# Altium schematic sheet Input_scheme.SchDoc
size A4
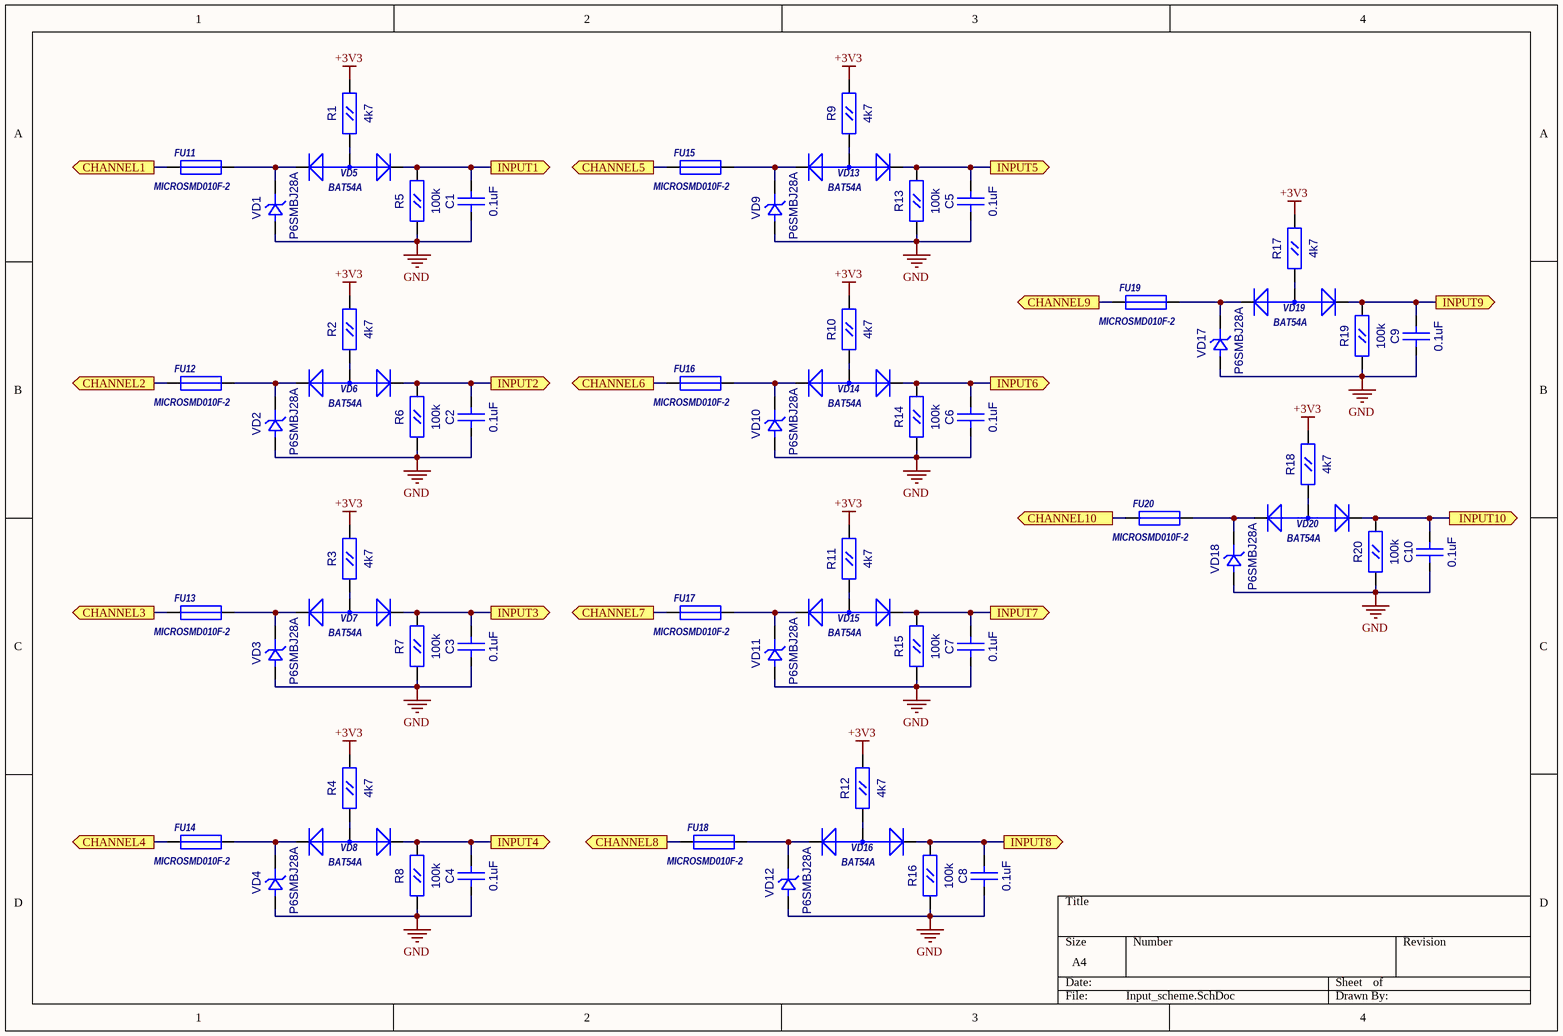
[diagram p0: Input_scheme.SchDoc]

## Parts
C1  0.1uF  [CC0603]
C2  0.1uF  [CC0603]
C3  0.1uF  [CC0603]
C4  0.1uF  [CC0603]
C5  0.1uF  [CC0603]
C6  0.1uF  [CC0603]
C7  0.1uF  [CC0603]
C8  0.1uF  [CC0603]
C9  0.1uF  [CC0603]
C10  0.1uF  [CC0603]
FU11  MICROSMD010F-2  [RC1210]
FU12  MICROSMD010F-2  [RC1210]
FU13  MICROSMD010F-2  [RC1210]
FU14  MICROSMD010F-2  [RC1210]
FU15  MICROSMD010F-2  [RC1210]
FU16  MICROSMD010F-2  [RC1210]
FU17  MICROSMD010F-2  [RC1210]
FU18  MICROSMD010F-2  [RC1210]
FU19  MICROSMD010F-2  [RC1210]
FU20  MICROSMD010F-2  [RC1210]
R1  4k7  [RC0603]
R2  4k7  [RC0603]
R3  4k7  [RC0603]
R4  4k7  [RC0603]
R5  100k  [RC0603]
R6  100k  [RC0603]
R7  100k  [RC0603]
R8  100k  [RC0603]
R9  4k7  [RC0603]
R10  4k7  [RC0603]
R11  4k7  [RC0603]
R12  4k7  [RC0603]
R13  100k  [RC0603]
R14  100k  [RC0603]
R15  100k  [RC0603]
R16  100k  [RC0603]
R17  4k7  [RC0603]
R18  4k7  [RC0603]
R19  100k  [RC0603]
R20  100k  [RC0603]
VD1  P6SMBJ28A  [SMB]
VD2  P6SMBJ28A  [SMB]
VD3  P6SMBJ28A  [SMB]
VD4  P6SMBJ28A  [SMB]
VD5  BAT54A  [SOT-23(123)]
VD6  BAT54A  [SOT-23(123)]
VD7  BAT54A  [SOT-23(123)]
VD8  BAT54A  [SOT-23(123)]
VD9  P6SMBJ28A  [SMB]
VD10  P6SMBJ28A  [SMB]
VD11  P6SMBJ28A  [SMB]
VD12  P6SMBJ28A  [SMB]
VD13  BAT54A  [SOT-23(123)]
VD14  BAT54A  [SOT-23(123)]
VD15  BAT54A  [SOT-23(123)]
VD16  BAT54A  [SOT-23(123)]
VD17  P6SMBJ28A  [SMB]
VD18  P6SMBJ28A  [SMB]
VD19  BAT54A  [SOT-23(123)]
VD20  BAT54A  [SOT-23(123)]

## Ports
CHANNEL1 (out), CHANNEL2 (out), CHANNEL3 (out), CHANNEL4 (out), CHANNEL5 (out), CHANNEL6 (out), CHANNEL7 (out), CHANNEL8 (out), CHANNEL9 (out), CHANNEL10 (out), INPUT1 (out), INPUT2 (out), INPUT3 (out), INPUT4 (out), INPUT5 (out), INPUT6 (out), INPUT7 (out), INPUT8 (out), INPUT9 (out), INPUT10 (out)

## Nets
+3V3: R1.2(B) R2.2(B) R3.2(B) R4.2(B) R9.2(B) R10.2(B) R11.2(B) R12.2(B) R17.2(B) R18.2(B)
GND: C1.1(A) C2.1(A) C3.1(A) C4.1(A) C5.1(A) C6.1(A) C7.1(A) C8.1(A) C9.1(A) C10.1(A) R5.1(A) R6.1(A) R7.1(A) R8.1(A) R13.1(A) R14.1(A) R15.1(A) R16.1(A) R19.1(A) R20.1(A) VD1.1(A) VD2.1(A) VD3.1(A) VD4.1(A) VD9.1(A) VD10.1(A) VD11.1(A) VD12.1(A) VD17.1(A) VD18.1(A)
CHANNEL1: FU11.1 ; port CHANNEL1
CHANNEL2: FU12.1 ; port CHANNEL2
CHANNEL3: FU13.1 ; port CHANNEL3
CHANNEL4: FU14.1 ; port CHANNEL4
CHANNEL5: FU15.1 ; port CHANNEL5
CHANNEL6: FU16.1 ; port CHANNEL6
CHANNEL7: FU17.1 ; port CHANNEL7
CHANNEL8: FU18.1 ; port CHANNEL8
CHANNEL9: FU19.1 ; port CHANNEL9
CHANNEL10: FU20.1 ; port CHANNEL10
INPUT1: C1.2(B) R5.2(B) VD5.2(K) ; port INPUT1
INPUT2: C2.2(B) R6.2(B) VD6.2(K) ; port INPUT2
INPUT3: C3.2(B) R7.2(B) VD7.2(K) ; port INPUT3
INPUT4: C4.2(B) R8.2(B) VD8.2(K) ; port INPUT4
INPUT5: C5.2(B) R13.2(B) VD13.2(K) ; port INPUT5
INPUT6: C6.2(B) R14.2(B) VD14.2(K) ; port INPUT6
INPUT7: C7.2(B) R15.2(B) VD15.2(K) ; port INPUT7
INPUT8: C8.2(B) R16.2(B) VD16.2(K) ; port INPUT8
INPUT9: C9.2(B) R19.2(B) VD19.2(K) ; port INPUT9
INPUT10: C10.2(B) R20.2(B) VD20.2(K) ; port INPUT10
NetFU11_2: FU11.2 VD1.2(K) VD5.1(K)
NetFU12_2: FU12.2 VD2.2(K) VD6.1(K)
NetFU13_2: FU13.2 VD3.2(K) VD7.1(K)
NetFU14_2: FU14.2 VD4.2(K) VD8.1(K)
NetFU15_2: FU15.2 VD9.2(K) VD13.1(K)
NetFU16_2: FU16.2 VD10.2(K) VD14.1(K)
NetFU17_2: FU17.2 VD11.2(K) VD15.1(K)
NetFU18_2: FU18.2 VD12.2(K) VD16.1(K)
NetFU19_2: FU19.2 VD17.2(K) VD19.1(K)
NetFU20_2: FU20.2 VD18.2(K) VD20.1(K)
NetR1_1: R1.1(A) VD5.3(A)
NetR2_1: R2.1(A) VD6.3(A)
NetR3_1: R3.1(A) VD7.3(A)
NetR4_1: R4.1(A) VD8.3(A)
NetR9_1: R9.1(A) VD13.3(A)
NetR10_1: R10.1(A) VD14.3(A)
NetR11_1: R11.1(A) VD15.3(A)
NetR12_1: R12.1(A) VD16.3(A)
NetR17_1: R17.1(A) VD19.3(A)
NetR18_1: R18.1(A) VD20.3(A)

## Library data of the parts
C1-C10 = CC0603: Value: 0.1uF
FU11-FU20 = MICROSMD: Value: MICROSMD010F-2
R1-R20 = RC0603
  R1-R4 R9-R12 R17 R18: Value: 4k7
  R5-R8 R13-R16 R19 R20: Value: 100k
VD1-VD4 VD9-VD12 VD17 VD18 = SMBJ: Value: P6SMBJ28A
VD5-VD8 VD13-VD16 VD19 VD20 = BAT54A: ComponentField6: Published 8-Jun-2000, Modified 11-July-2000: SIM Model Added.; Value: *